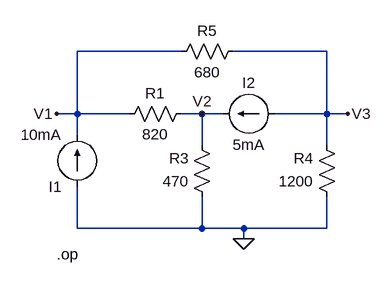
[diagram p0: schematic nodal2.asc]
nodal2.asc, the LTspice schematic file:
Version 4
SHEET 1 880 680
WIRE 144 16 -16 16
WIRE 368 16 224 16
WIRE -16 112 -16 16
WIRE -16 112 -48 112
WIRE 64 112 -16 112
WIRE 176 112 144 112
WIRE 208 112 176 112
WIRE 368 112 368 16
WIRE 368 112 288 112
WIRE 400 112 368 112
WIRE -16 144 -16 112
WIRE 176 160 176 112
WIRE 368 160 368 112
WIRE -16 288 -16 224
WIRE 176 288 176 240
WIRE 176 288 -16 288
WIRE 240 288 176 288
WIRE 368 288 368 240
WIRE 368 288 240 288
WIRE 240 304 240 288
FLAG 176 112 V2
FLAG 400 112 V3
FLAG 240 304 0
FLAG -48 112 V1
SYMBOL res 160 96 R90
WINDOW 0 0 56 VBottom 2
WINDOW 3 32 56 VTop 2
SYMATTR InstName R1
SYMATTR Value 820
SYMBOL res 384 256 R180
WINDOW 0 36 76 Left 2
WINDOW 3 36 40 Left 2
SYMATTR InstName R4
SYMATTR Value 1200
SYMBOL res 192 256 R180
WINDOW 0 36 76 Left 2
WINDOW 3 36 40 Left 2
SYMATTR InstName R3
SYMATTR Value 470
SYMBOL res 128 32 R270
WINDOW 0 32 56 VTop 2
WINDOW 3 0 56 VBottom 2
SYMATTR InstName R5
SYMATTR Value 680
SYMBOL current -16 224 R180
WINDOW 123 0 0 Left 0
WINDOW 39 0 0 Left 0
SYMATTR InstName I1
SYMATTR Value 10mA
SYMBOL current 288 112 R90
WINDOW 0 -32 40 VBottom 2
WINDOW 3 32 40 VTop 2
WINDOW 123 0 0 Left 0
WINDOW 39 0 0 Left 0
SYMATTR InstName I2
SYMATTR Value 5mA
TEXT -48 328 Left 2 !.op

The netlist it stands for:
* nodal2.asc
R1 V2 V1 820
R4 0 V3 1200
R3 0 V2 470
R5 V1 V3 680
I1 0 V1 10mA
I2 V3 V2 5mA
.op
.backanno
.end

* Results of the author's LTspice run, read from the files saved beside the schematic
* Operating Point:
*   V(v2) = 3.899 V
*   V(v1) = 6.603 V
*   V(v3) = 2.044 V
*   I(I2) = 5 mA
*   I(I1) = 10 mA
*   I(R5) = 6.703 mA
*   I(R3) = -8.297 mA
*   I(R4) = -1.703 mA
*   I(R1) = -3.297 mA